# EAGLE design lp_pic32 (EAGLE 7.5.0)
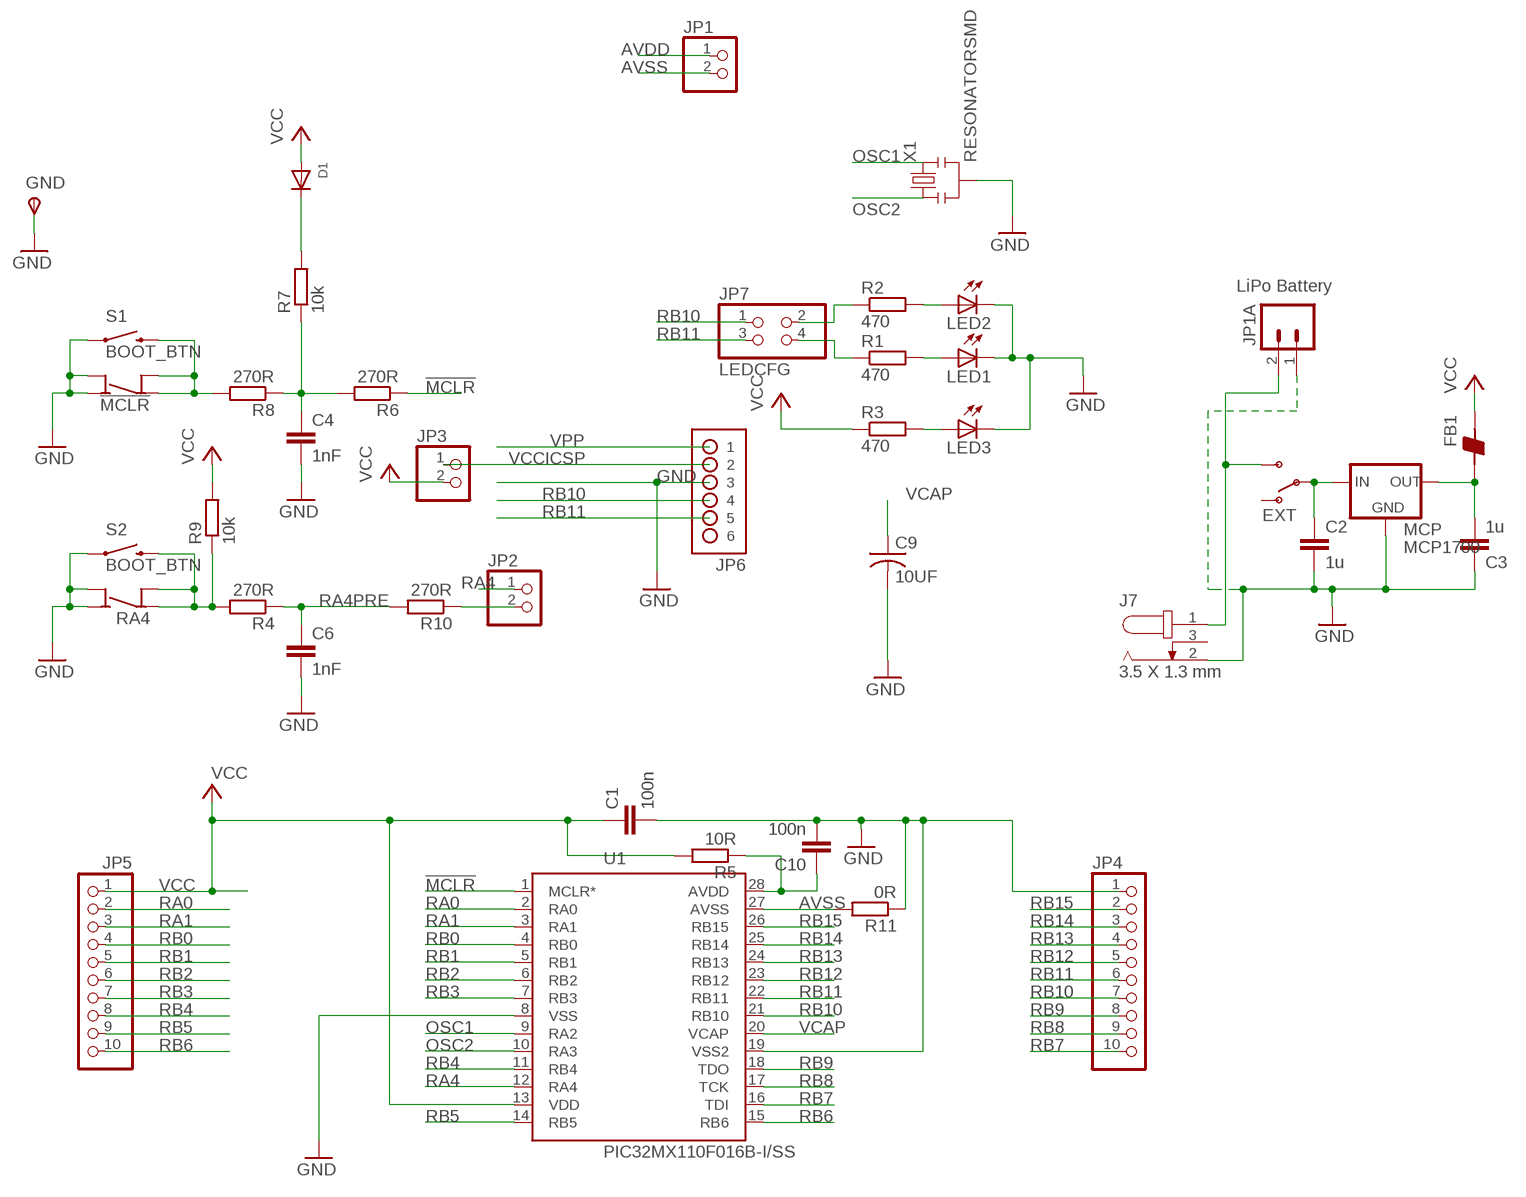
[diagram p0: schematic, sheet 1]

## Parts
!MCLR  !MCLR  SPST4  [6MMTACTILE_4PIN]
C1  100n  C-EUC0805  [C0805]
C2  1u  C-EUC0805  [C0805]
C3  1u  C-EUC0805  [C0805]
C4  1nF  C-EUC0805  [C0805]
C6  1nF  C-EUC0805  [C0805]
C9  10UF  C-USC1206  [C1206]
C10  100n  C-EUC0805  [C0805]
D1  DIODESOD-323F  [SOD-323F]
FB1  BEAD-0805  [0805]
GND  TPSTP20R  [TP20R]
J7  3.5 X 1.3 mm  DC_JACK_3.5X1.3MM  [3.5X1.3MM_DC_JACK]
JP1  PINHD-1X2  [1X02]
JP1A  LiPo Battery  M02JST-PTH-2  [JST-2-PTH]
JP2  PINHD-1X2  [1X02]
JP3  PINHD-1X2  [1X02]
JP4  PH1X10OCT076  [PH1X10OCT76]
JP5  PH1X10OCT076  [PH1X10OCT76]
JP6  No Load  HDR-1X6-OFFSET  [HDR-1X6_OFFSET]
JP7  LEDCFG  PINHD-2X2  [2X02]
LED1  0  LEDCHIPLED_1206  [CHIPLED_1206]
LED2  0  LEDCHIPLED_1206  [CHIPLED_1206]
LED3  0  LEDCHIPLED_1206  [CHIPLED_1206]
MCP  MCP1700  MCP1700SOT-23  [SOT-23]
ON  EXT  SWITCH-SPSTPTH  [SWITCH-SPDT]
R1  470  R-EU_R0805  [R0805]
R2  470  R-EU_R0805  [R0805]
R3  470  R-EU_R0805  [R0805]
R4  270R  R-EU_R0805  [R0805]
R5  10R  R-EU_R0805  [R0805]
R6  270R  R-EU_R0805  [R0805]
R7  10k  R-EU_R0805  [R0805]
R8  270R  R-EU_R0805  [R0805]
R9  10k  R-EU_R0805  [R0805]
R10  270R  R-EU_R0805  [R0805]
R11  0R  R-EU_R0805  [R0805]
RA4  RA4  SPST4  [6MMTACTILE_4PIN]
S1  BOOT_BTN  SWITCH-MOMENTARY-2-SMD-1101NE  [TACTILE-SWITCH-1101NE]
S2  BOOT_BTN  SWITCH-MOMENTARY-2-SMD-1101NE  [TACTILE-SWITCH-1101NE]
U1  PIC32MX110F016B-I/SS  [SOP65P780X200-28N]
X1  RESONATORSMD  [RESONATOR-SMD]

## Nets
!MCLR: R6.1 U1.1(MCLR*)
AVDD [VCC]: C10.1 JP1.1 R5.1 U1.28(AVDD)
AVSS [GND]: JP1.2 R11.2 U1.27(AVSS)
GND [GND]: !MCLR.A1(NO) !MCLR.A2(NO) C1.2 C2.2 C3.1 C4.2 C6.2 C9.2 C10.2 GND.TP(PP) J7.2 JP1A.1 JP4.1 JP6.3 LED1.C LED2.C LED3.C MCP.1(GND) R11.1 RA4.A1(NO) RA4.A2(NO) S1.1 S2.1 U1.8(VSS) U1.19(VSS2) X1.2
N$1: JP7.2 R2.1
N$2: JP7.4 R1.1
N$3 [VCC]: C2.1 MCP.3(IN) ON.2(P)
N$4: R4.2 R9.1 RA4.B1(COM) RA4.B2(COM) S2.2
N$5: !MCLR.B1(COM) !MCLR.B2(COM) R8.2 S1.2
N$6 [VCC]: C3.2 FB1.1 MCP.2(OUT)
N$7: D1.C R7.2
N$9: JP2.2 R10.1
N$11: LED3.A R3.2
N$13: LED1.A R1.2
N$14: LED2.A R2.2
OSC1: U1.9(RA2) X1.3
OSC2: U1.10(RA3) X1.1
RA0: JP5.2 U1.2(RA0)
RA1: JP5.3 U1.3(RA1)
RA4: JP2.1 U1.12(RA4)
RA4PRE: C6.1 R4.1 R10.2
RB0: JP5.4 U1.4(RB0)
RB1: JP5.5 U1.5(RB1)
RB2: JP5.6 U1.6(RB2)
RB3: JP5.7 U1.7(RB3)
RB4: JP5.8 U1.11(RB4)
RB5: JP5.9 U1.14(RB5)
RB6: JP5.10 U1.15(RB6)
RB7: JP4.10 U1.16(TDI)
RB8: JP4.9 U1.17(TCK)
RB9: JP4.8 U1.18(TDO)
RB10: JP4.7 JP6.4 JP7.1 U1.21(RB10)
RB11: JP4.6 JP6.5 JP7.3 U1.22(RB11)
RB12: JP4.5 U1.23(RB12)
RB13: JP4.4 U1.24(RB13)
RB14: JP4.3 U1.25(RB14)
RB15: JP4.2 U1.26(RB15)
VCAP: C9.1 U1.20(VCAP)
VCC [VCC]: C1.1 D1.A FB1.2 JP3.2 JP5.1 R3.1 R5.2 R9.2 U1.13(VDD)
VCCEXT [VCC]: J7.1 JP1A.2 ON.3(S)
VCCICSP [VCC]: JP3.1 JP6.2
VPP: C4.1 JP6.1 R6.2 R7.1 R8.1
Unconnected: J7.3 JP6.6 ON.1(O)

## Library data of the parts
!MCLR RA4 = mes_electromech:SPST4: SPST switch with 2 pins per contact
C1-C3 C10 = rcl:C-EU: CAPACITOR, European symbol
C4 C6 = resistor:C-EU: CAPACITOR, European symbol
C9 = rcl:C-US: CAPACITOR, American symbol
D1 = adafruit:DIODE: Diode SMADIODE - SMA Surface Mount Package 20V 1A Schottky Diode Digikey: 641-1014-6-ND DO-1N4148 - Through Hole Small Current Diode SOD-123 20V 1 A (.5mV Vf) Schottky Diode - Digikey: MBRX120TPMSCT-ND SOD-323 10V 570mA (.38mV Vf, 3ns) Schottky Diode - Digikey: ZLLS410CT-ND SOD-523 30V 30mA Schottky Diode (RB751S-40TE61) - Digikey: RB751S-40TE61CT-ND SOT23-R/W - SOT23 Package (R = Solder Paste/Reflow Ovens, W = Hand-Soldering) BAT54Film 40V 300mA - Digikey: 497-7162-1-ND
FB1 = CH_passive:BEAD
GND = testpad:TPS: TEST PIN
J7 = MY_CONN:DC_JACK_3.5X1.3MM
JP1-JP3 = pinhead:PINHD-1X2: PIN HEADER
JP1A = SparkFun:M02: Header 2 Standard 2-pin 0.1" header. Use with straight break away headers (SKU : PRT-00116), right angle break away headers (PRT-00553), swiss pins (PRT-00743), machine pins (PRT-00117), and female headers (PRT-00115). Molex polarized connector foot print use with SKU : PRT-08233 with associated crimp pins and housings.
JP4 JP5 = MY_CONN:PH1X10
JP6 = Mechanical:HDR-1X6-OFFSET: 42 mil hole pattern with 16mil offset for jtag connector
JP7 = pinhead:PINHD-2X2: PIN HEADER
LED1-LED3 = led:LED: LED OSRAM: - CHIPLED LG R971, LG N971, LY N971, LG Q971, LY Q971, LO R971, LY R971 LH N974, LH R974 LS Q976, LO Q976, LY Q976 LO Q996 - Hyper CHIPLED LW Q18S LB Q993, LB Q99A, LB R99A - SideLED LS A670, LO A670, LY A670, LG A670, LP A670 LB A673, LV A673, LT A673, LW A673 LH A674 LY A675 LS A676, LA A676, LO A676, LY A676, LW A676 LS A679, LY A679, LG A679 - Hyper Micro SIDELED® LS Y876, LA Y876, LO Y876, LY Y876 LT Y87S - SmartLED LW L88C, LW L88S LB L89C, LB L89S, LG L890 LS L89K, LO L89K, LY L89K LS L896, LA L896, LO L896, LY L896 - TOPLED LS T670, LO T670, LY T670, LG T670, LP T670 LSG T670, LSP T670, LSY T670, LOP T670, LYG T670 LG T671, LOG T671, LSG T671 LB T673, LV T673, LT T673, LW T673 LH T674 LS T676, LA T676, LO T676, LY T676, LB T676, LH T676, LSB T676, LW T676 LB T67C, LV T67C, LT T67C, LS T67K, LO T67K, LY T67K, LW E67C LS E67B, LA E67B, LO E67B, LY E67B, LB E67C, LV E67C, LT E67C LW T67C LS T679, LY T679, LG T679 LS T770, LO T770, LY T770, LG T770, LP T770 LB T773, LV T773, LT T773, LW T773 LH T774 LS E675, LA E675, LY E675, LS T675 LS T776, LA T776, LO T776, LY T776, LB T776 LHGB T686 LT T68C, LB T68C - Hyper Mini TOPLED® LB M676 - Mini TOPLED Santana® LG M470 LS M47K, LO M47K, LY M47K Source: http://www.osram.convergy.de LUXEON: - LUMILED® LXK2-PW12-R00, LXK2-PW12-S00, LXK2-PW14-U00, LXK2-PW14-V00 LXK2-PM12-R00, LXK2-PM12-S00, LXK2-PM14-U00 LXK2-PE12-Q00, LXK2-PE12-R00, LXK2-PE12-S00, LXK2-PE14-T00, LXK2-PE14-U00 LXK2-PB12-K00, LXK2-PB12-L00, LXK2-PB12-M00, LXK2-PB14-N00, LXK2-PB14-P00, LXK2-PB14-Q00 LXK2-PR12-L00, LXK2-PR12-M00, LXK2-PR14-Q00, LXK2-PR14-R00 LXK2-PD12-Q00, LXK2-PD12-R00, LXK2-PD12-S00 LXK2-PH12-R00, LXK2-PH12-S00 LXK2-PL12-P00, LXK2-PL12-Q00, LXK2-PL12-R00 Source: www.luxeon.com KINGBRIGHT: KA-3528ASYC Source: www.kingbright.com
MCP = MY_IC:MCP1700
ON = SparkFun:SWITCH-SPST: SPST Switch Simple slide switch. Spark Fun Electronics SKU : COM-00102
R1-R11 = resistor:R-EU_: RESISTOR, European symbol
S1 S2 = SparkFun-Electromechanical:SWITCH-MOMENTARY-2: Various NO switches- pushbuttons, reed, etc
U1 = Microchip-PIC32MX1-2-3-4-5-6-7:PIC32MX: IC,32-bit Microcontrollers (up to 128 KB Flash and 32 KB SRAM) with Audio and Graphics Interfaces, USB, and Advanced Analog; MPN: PIC32MX110F016B-I/SS; OC_FARNELL: 2057067; OC_NEWARK: 39T6776; PACKAGE: 28-Lead SSOP; SUPPLIER: Microchip
X1 = SparkFun02-20-08:RESONATOR: Resonator Small SMD resonator. This is the itty bitty 10/20MHz resonators with built in caps. CSTCE10M0G55 and CSTCE20M0V53. Footprint has been reviewed closely but hasn t been tested yet.'

## Net classes
0 default: width 0.406 mm, drill 0.508 mm
1 GND: width 0.508 mm, drill 0.508 mm
2 VCC: width 1.016 mm, drill 0.508 mm
4 VCCEXT: width 0.762 mm, drill 0.508 mm

## Board
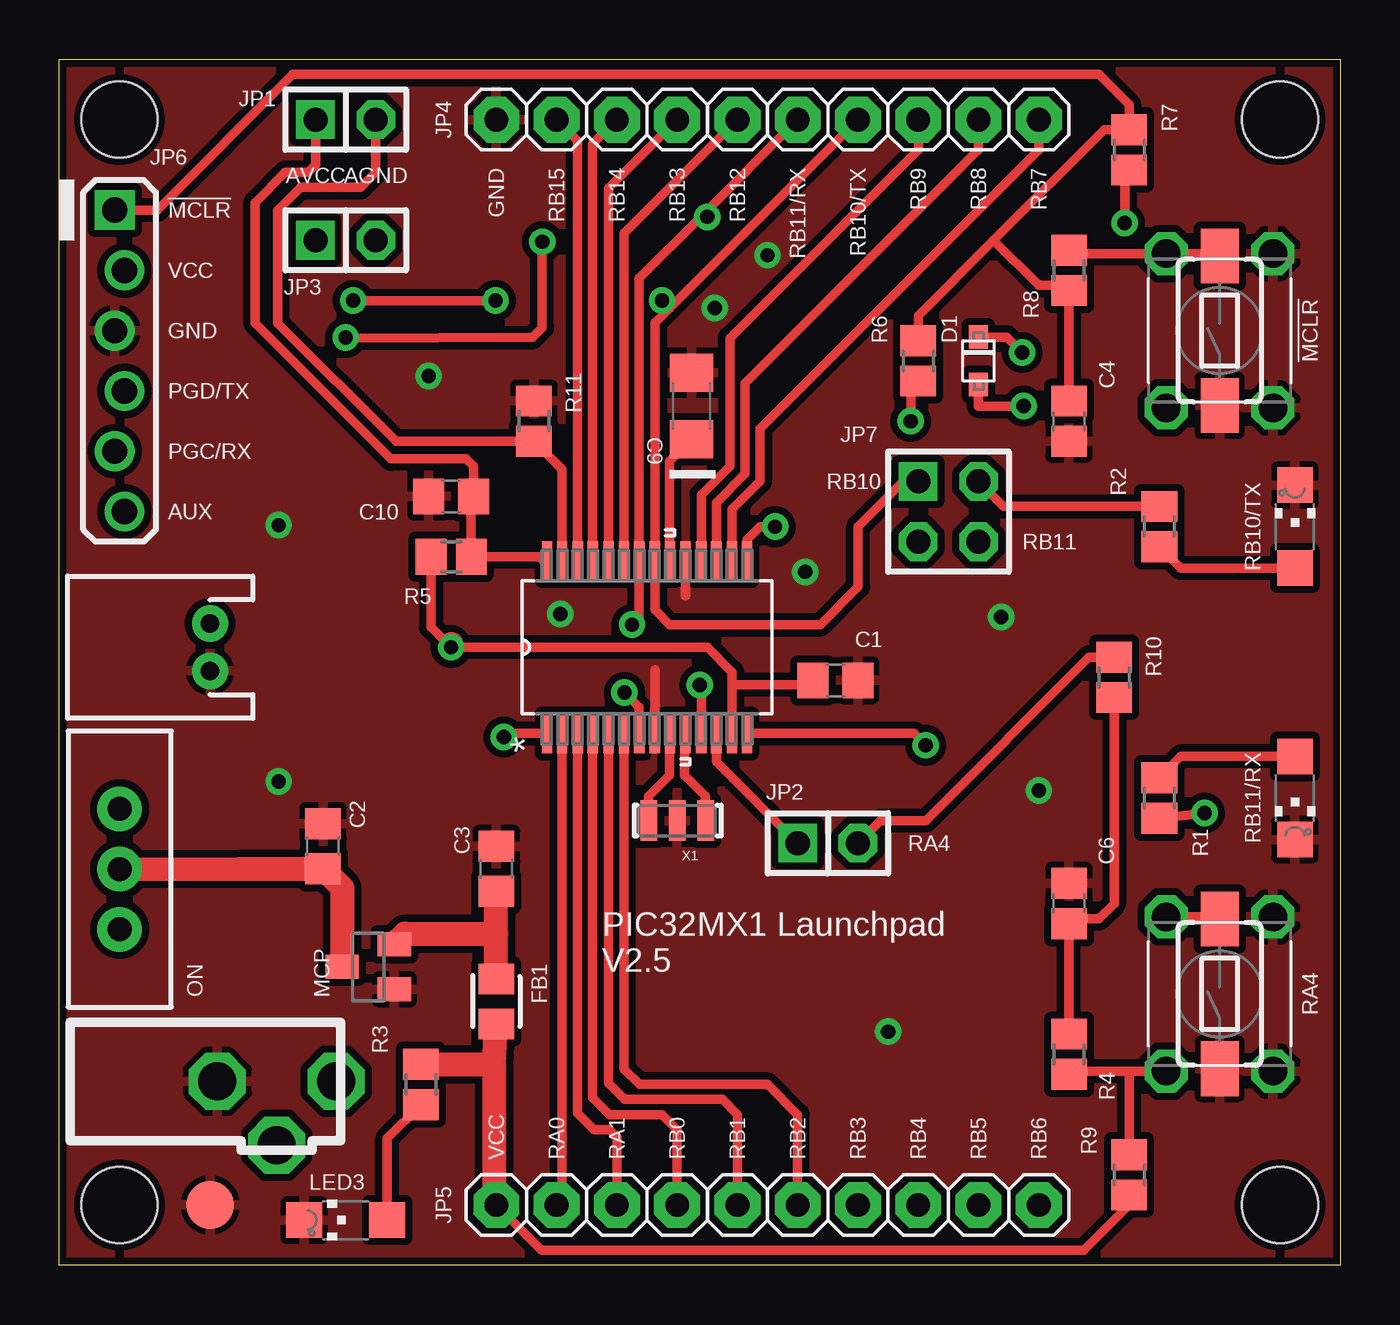
[diagram p1: board, top side]
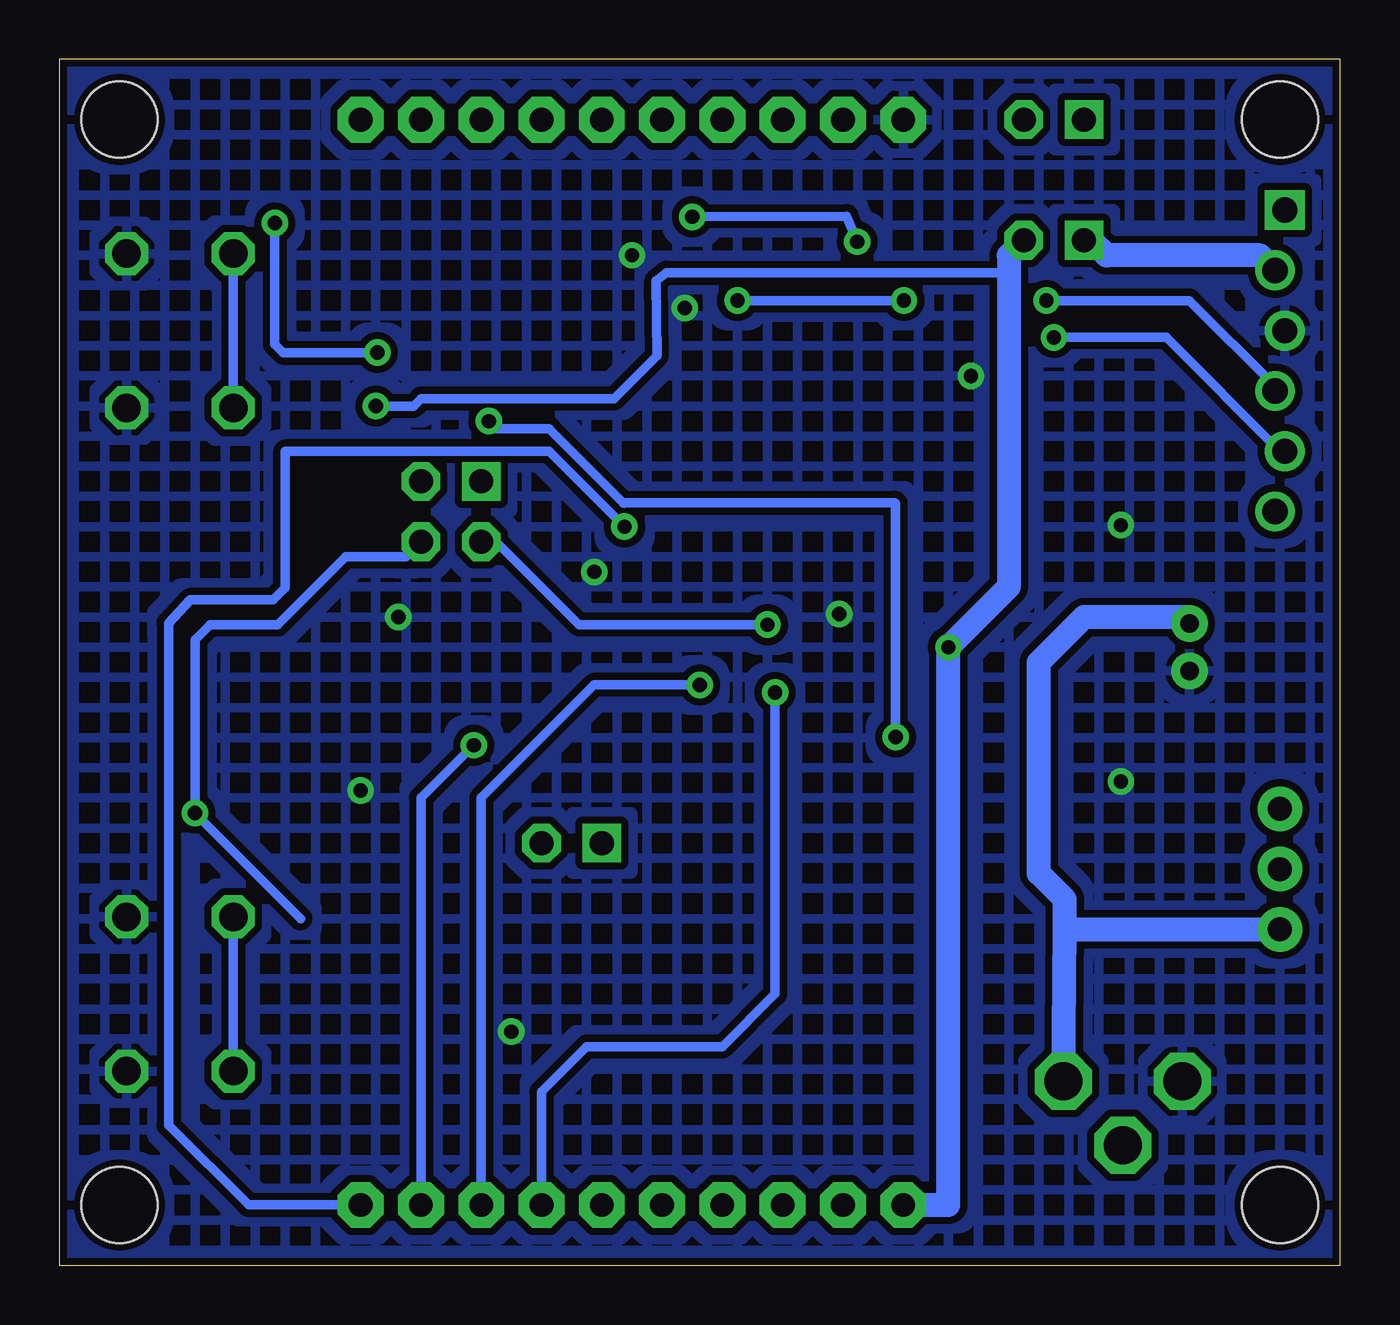
[diagram p2: board, bottom side, seen from below]

Size 53.97 x 50.8 mm. Coordinates in mm from the lower left corner, seen from the top.
Outline: 0,50.8 53.97,50.8 53.97,0 0,0 0,50.8
Copper layers (1*16): Top 0.035mm / dielectric 1.5mm / Bottom 0.035mm
Design rules "SparkFun *": minimum track width 8mil, minimum drill 20mil, track to track 7mil, track to pad 7mil, pad to pad 7mil, via to via 7mil, smd to smd 7mil, copper to edge 10mil, drill to drill 8mil, minimum pad ring 12mil, minimum via ring 10mil, stop-mask expansion 4mil, vias tented up to drill 25mil, thermal gap 10mil
Holes 3.2 mm at 2.54,48.26 51.44,48.26 51.44,2.54 2.54,2.54

### Footprints (pad centres in the part's own frame; a part is rotated, then mirrored left to right if it is on the bottom)
6MMTACTILE_4PIN = drill 1.2 octagon: A1 3.25,-2.25; A2 -3.25,-2.25; B1 3.25,2.25; B2 -3.25,2.25
C0805 = smd 1.3 x 1.5: 1 -0.95,0; 2 0.95,0
C0805' = smd 1.3 x 1.5: 1 -0.85,0; 2 0.85,0
C1206 = smd 1.6 x 1.8: 1 -1.4,0; 2 1.4,0
SOD-323F = smd 1 x 0.8: A -1,0; C 1,0
0805 = smd 1.3 x 1.5: 1 -0.95,0; 2 0.95,0
TP20R = smd 2 x 2: TP 0,0
3.5X1.3MM_DC_JACK = drill 1.6 octagon: 1 0,0; 2 -5,0; 3 -2.5,-2.7
1X02 = drill 1.016 square: 1 -1.27,0 | drill 1.016 octagon: 2 1.27,0
JST-2-PTH = drill 0.787 pad 1.524: 1 -1,0; 2 1,0
PH1X10OCT76 = drill 1 pad 1.93 octagon: 1 0,0; 2 2.54,0; 3 5.08,0; 4 7.62,0; 5 10.16,0; 6 12.7,0; 7 15.24,0; 8 17.78,0; 9 20.32,0; 10 22.86,0
HDR-1X6_OFFSET = drill 1.067 square: 1 -0.203,6.35 | drill 1.067: 2 0.203,3.81; 3 -0.203,1.27; 4 0.203,-1.27; 5 -0.203,-3.81; 6 0.203,-6.35
2X02 = drill 1.016 square: 1 -1.27,-1.27 | drill 1.016 octagon: 2 -1.27,1.27; 3 1.27,-1.27; 4 1.27,1.27
CHIPLED_1206 = smd 1.5 x 1.5: A 0,-1.75; C 0,1.75
SOT-23 = smd 1 x 1.4: 1 -0.95,-1.1; 2 0.95,-1.1; 3 0,1.1
SWITCH-SPDT = drill 1.016 pad 1.88: 1 0,2.54; 2 0,0; 3 0,-2.54
R0805 = smd 1.3 x 1.5: 1 -0.85,0; 2 0.85,0
TACTILE-SWITCH-1101NE = smd 2.3 x 1.6: 1 -3.15,0; 2 3.15,0
SOP65P780X200-28N = smd 1.651 x 0.432: 1 -3.632,4.216; 2 -3.632,3.581; 3 -3.632,2.921; 4 -3.632,2.286; 5 -3.632,1.626; 6 -3.632,0.965; 7 -3.632,0.33; 8 -3.632,-0.33; 9 -3.632,-0.965; 10 -3.632,-1.626; 11 -3.632,-2.286; 12 -3.632,-2.921; 13 -3.632,-3.581; 14 -3.632,-4.216; 15 3.632,-4.216; 16 3.632,-3.581; 17 3.632,-2.921; 18 3.632,-2.286; 19 3.632,-1.626; 20 3.632,-0.965; 21 3.632,-0.33; 22 3.632,0.33; 23 3.632,0.965; 24 3.632,1.626; 25 3.632,2.286; 26 3.632,2.921; 27 3.632,3.581; 28 3.632,4.216
RESONATOR-SMD = smd 0.7 x 1.7: 1 -1.2,0; 2 0,0; 3 1.2,0

### Placement (x,y rotation side)
!MCLR  48.89,39.37 90 top
C1  32.7,24.64 0 top
C2  11.11,17.65 90 top
C3  18.42,16.7 270 top
C4  1nF  [C0805']  42.55,35.56 270 top
C6  1nF  [C0805']  42.55,15.24 90 top
C9  26.64,36.2 90 top
C10  16.51,32.39 180 top
D1  38.73,38.1 90 top
FB1  18.42,11.11 270 top
GND  6.35,2.54 0 top
J7  11.66,7.75 0 top
JP1  12.07,48.26 0 top
JP1A  6.35,26.04 90 top
JP2  32.39,17.78 0 top
JP3  12.07,43.18 0 top
JP4  18.42,48.26 0 top
JP5  18.42,2.54 0 top
JP6  2.54,38.1 0 top
JP7  37.47,31.75 270 top
LED1  52.07,19.68 180 top
LED2  52.07,31.11 0 top
LED3  12.07,1.91 90 top
MCP  13.02,12.57 90 top
ON  2.54,16.69 0 top
R1  46.35,19.68 90 top
R2  46.35,31.11 270 top
R3  15.24,7.62 270 top
R4  42.55,8.89 270 top
R5  16.51,29.84 180 top
R6  36.19,38.1 90 top
R7  45.08,46.99 270 top
R8  42.55,41.91 90 top
R9  45.08,3.81 270 top
R10  44.45,24.76 270 top
R11  20,35.56 270 top
RA4  48.89,11.43 90 top
S1  48.89,39.37 90 top
S2  48.89,11.43 90 top
U1  24.76,26.04 90 top
X1  26.04,18.73 180 top

### Tracks (layer width: path | path; a pad name or v marks a point on that pad's centre or on a via)
!MCLR  (via drill 0.6)
  Top 0.406: v18.73,22.26 18.88,22.4 U1.1 | R6.1 35.88,36.93 v35.88,35.56
  Bottom 0.406: v18.73,22.26 18.73,32.1 18.76,32.13 30.13,32.13 30.16,32.1 30.19,32.1 33.34,35.24 35.56,35.24 v35.88,35.56
AVDD
  Top 0.406: U1.28 20.39,29.67 20.22,29.84 R5.1 17.36,32.29 C10.1 17.46,33.66 17.14,33.97 13.97,33.97 8.25,39.69 8.25,44.77 9.52,46.04 10.48,46.04 10.79,46.36 JP1.1
AVSS
  Top 0.406: U1.27 21.18,33.53 R11.2 14.18,34.71 9.21,39.69 9.21,44.45 10.16,45.4 12.7,45.4 13.33,46.04 JP1.2
GND  (via drill 0.6)
  Top 0.406: U1.19 26.38,29.55 26.38,28.19 | U1.8 25.1,25.09 25.08,21.91
  other vias: 21.11,27.43 39.69,27.3 9.24,20.38 9.24,31.18 27.62,40.32 29.85,42.55 31.43,29.21 34.92,9.84 41.28,20 15.56,37.47
  pour Top (isolate 0.305): -0.25,-0.51 54.99,-0.51 54.99,51.31 -0.25,51.31
  pour Bottom (isolate 0.305, hatched): -0.25,-0.51 54.99,-0.51 54.99,51.31 -0.25,51.31
N$1
  Top 0.406: 46.57,31.75 R2.1 39.79,31.96 JP7.2
N$2  (via drill 0.6)
  Top 0.406: R1.1 v48.26,19.05
  Bottom 0.406: 43.81,14.61 v48.26,19.05 48.26,26.35 47.62,26.99 44.77,26.99 41.91,29.84 39.37,29.84 JP7.4
N$3
  Top 1.016: ON.2 7.64,16.7 C2.1 11.92,15.9 MCP.3
N$4
  Top 0.406: RA4.B2 45.08,8.18 | 45.08,8.18 42.69,8.18 R4.2 | S2.2 48.8,14.68 RA4.B1 | R9.1 45.08,8.18
  Bottom 0.406: RA4.B1 RA4.B2
N$5
  Top 0.406: R8.2 42.69,42.62 !MCLR.B1 48.8,42.62 S1.2
  Bottom 0.406: !MCLR.B1 !MCLR.B2
N$6
  Top 1.016: FB1.1 18.42,13.97 | 18.42,13.97 C3.2 | MCP.2 14.56,13.97 18.42,13.97
N$7  (via drill 0.6)
  Top 0.406: R7.2 44.89,45.95 v44.89,43.91 | v40.58,38.45 39.93,39.1 D1.C
  Bottom 0.406: v44.89,43.91 44.89,38.8 44.55,38.45 v40.58,38.45
N$9
  Top 0.406: R10.1 43.39,25.61 36.51,18.73 34.61,18.73 JP2.2
N$11
  Top 0.406: LED3.A 13.82,5.35 R3.2
N$13
  Top 0.406: LED1.A 47.25,21.43 R1.2
N$14
  Top 0.406: LED2.A 47.25,29.36 R2.2
OSC1
  Top 0.406: X1.3 24.83,19.75 25.72,20.64 25.72,22.39 U1.9
OSC2
  Top 0.406: X1.1 27.24,19.75 26.35,20.64 26.35,22.36 U1.10
RA0
  Top 0.406: JP5.2 21.18,2.77 U1.2
RA1
  Top 0.406: JP5.3 23.5,5.4 23.18,5.71 22.54,5.71 21.84,6.41 U1.3
RA4
  Top 0.406: JP2.1 27.69,21.21 U1.12
RA4PRE
  Top 0.406: R4.1 C6.1 42.76,14.61 43.81,14.61 44.45,15.24 R10.2
RB0
  Top 0.406: JP5.4 26.04,5.71 25.4,6.35 23.18,6.35 22.48,7.05 U1.4
RB1
  Top 0.406: JP5.5 28.57,6.35 27.94,6.99 23.81,6.99 23.14,7.66 U1.5
RB2
  Top 0.406: JP5.6 31.11,6.35 29.85,7.62 24.45,7.62 23.8,8.27 U1.6
RB3  (via drill 0.6)
  Top 0.406: U1.7 24.43,23.51 v23.81,24.13
  Bottom 0.406: v23.81,24.13 23.81,11.43 26.04,9.21 31.75,9.21 33.66,7.3 JP5.7
RB4  (via drill 0.6)
  Top 0.406: U1.11 27.05,24.38 v26.99,24.45
  Bottom 0.406: v26.99,24.45 31.43,24.45 36.19,19.68 JP5.8
RB5  (via drill 0.6)
  Top 0.406: U1.14 36.02,22.4 v36.51,21.91
  Bottom 0.406: v36.51,21.91 38.73,19.68 JP5.9
RB6  (via drill 0.6)
  Top 0.406: v30.16,31.11 29.53,31.11 28.98,30.57 U1.15
  Bottom 0.406: JP5.10 46.01,2.54 49.37,5.91 49.37,27.05 48.45,28.04 44.96,28.04 44.45,28.54 44.45,34.29 33.34,34.29 v30.16,31.11
RB7
  Top 0.406: U1.16 28.35,31.84 29.53,33.02 29.53,35.24 41.28,46.99 JP4.10
RB8
  Top 0.406: U1.17 27.69,32.13 28.89,33.34 28.89,37.15 38.73,46.99 JP4.9
RB9
  Top 0.406: U1.18 27.05,32.45 28.26,33.66 28.26,39.05 36.19,46.99 JP4.8
RB10  (via drill 0.6)
  Top 0.406: JP4.7 25.72,40.32 | 25.72,40.32 25.1,39.7 U1.21 25.1,27.61 25.72,26.99 32.07,26.99 33.66,28.57 33.66,31.11 35.56,33.02 JP7.1 | v12.38,40.64 v18.38,40.64 | v25.4,40.64 25.72,40.32
  Bottom 0.406: v12.38,40.64 6.35,40.64 2.74,37.03 JP6.4 | v18.38,40.64 v25.4,40.64
RB11  (via drill 0.6)
  Top 0.406: JP4.6 26.99,44.13 | 26.99,44.13 24.43,41.58 U1.22 24.43,27 v24.13,26.99 | v12.07,39.08 12.07,39.05 19.94,39.08 20.35,39.5 v20.35,43.12 | v27.31,44.16 27.27,44.13 26.99,44.13
  Bottom 0.406: v12.07,39.08 7.33,39.08 2.54,34.29 JP6.5 | v20.35,43.12 20.8,44.2 v27.31,44.16 | v24.13,26.99 32.07,26.99 35.56,30.48 JP7.3
RB12
  Top 0.406: JP4.5 23.8,43.48 U1.23
RB13
  Top 0.406: JP4.4 23.14,45.36 U1.24
RB14
  Top 0.406: JP4.3 22.48,47.24 U1.25
RB15
  Top 0.406: JP4.2 21.84,47.37 U1.26
VCAP
  Top 0.406: U1.20 25.72,29.68 25.72,33.87 C9.1
VCC  (via drill 0.6)
  Top 0.406: R9.2 45.08,2.54 43.18,0.64 20.32,0.64 JP5.1 | D1.A 38.73,36.2 v40.64,36.2 | 28.35,24.45 28.35,24.99 27.31,26.04 v16.51,26.04 15.66,26.88 R5.2 | 28.35,24.45 U1.13 | C1.1 31.56,24.45 28.35,24.45
  Top 1.016: R3.1 18.31,8.47 | 18.31,8.47 FB1.2 | 18.31,8.47 18.31,2.64 JP5.1 | 16.51,26.16 v16.51,26.04
  Bottom 0.406: v40.64,36.2 39.05,36.2 38.73,36.51 30.61,36.51 28.8,38.32 28.83,41.47 28.38,41.82 13.94,41.82 13.94,41.88 13.97,41.91
  Bottom 1.016: JP5.1 16.51,2.54 v16.51,26.04 13.97,28.57 13.97,41.91 13.97,42.55 JP3.2
VCCEXT
  Bottom 1.016: J7.1 11.61,14.15 | 11.61,14.15 ON.3 | JP1A.2 6.35,27.3 10.79,27.3 12.7,25.4 12.7,16.51 11.61,15.42 11.61,14.15
VCCICSP
  Bottom 1.016: JP6.2 3.38,42.55 9.84,42.55 10.48,43.18 JP3.1
VPP
  Top 0.406: C4.1 R8.1 42.33,41.27 41.28,41.27 39.37,43.18 | 39.37,43.18 44.03,47.84 R7.1 45.08,48.9 43.81,50.16 9.84,50.16 4.13,44.45 JP6.1 | 39.37,43.18 36.19,40.01 R6.2

### Text on the board
tPlace: RB10 | RB10/TX | RB11 | RB11/RX | RA4 | PIC32MX1 Launchpad / V2.5
tNames: AVCC | AGND | GND | RB15 | RB14 | RB13 | RB12 | RB11/RX | RB10/TX | RB9 | RB8 | RB7 | !MCLR | VCC | GND | PGD/TX | PGC/RX | AUX | ON | VCC | RA0 | RA1 | RB0 | RB1 | RB2 | RB3 | RB4 | RB5 | RB6